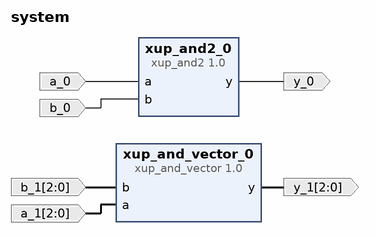
[diagram p0: block diagram of the top level]
# Vivado block design system, xc7a35tcpg236-1, Vivado 2019.2
create_bd_design system

create_bd_port -dir O y_0
create_bd_port -dir I a_0
create_bd_port -dir I b_0
create_bd_port -dir O -from 2 -to 0 y_1
create_bd_port -dir I -from 2 -to 0 b_1
create_bd_port -dir I -from 2 -to 0 a_1

create_bd_cell -type ip -vlnv xilinx.com:xup:xup_and2:1.0 xup_and2_0
set_property -dict {CONFIG.DELAY 3} [get_bd_cells xup_and2_0]
create_bd_cell -type ip -vlnv xilinx.com:xup:xup_and_vector:1.0 xup_and_vector_0
set_property -dict {CONFIG.DELAY 2 CONFIG.SIZE 3} [get_bd_cells xup_and_vector_0]

# ---- connections ----

connect_bd_net [get_bd_pins xup_and2_0/y] [get_bd_ports y_0]
connect_bd_net -net a_0_1 [get_bd_ports a_0] [get_bd_pins xup_and2_0/a]
connect_bd_net -net b_0_1 [get_bd_ports b_0] [get_bd_pins xup_and2_0/b]
connect_bd_net [get_bd_pins xup_and_vector_0/y] [get_bd_ports y_1]
connect_bd_net -net b_1_1 [get_bd_ports b_1] [get_bd_pins xup_and_vector_0/b]
connect_bd_net -net a_1_1 [get_bd_ports a_1] [get_bd_pins xup_and_vector_0/a]

validate_bd_design
save_bd_design
